# EAGLE design main0 (EAGLE 8.3.1)
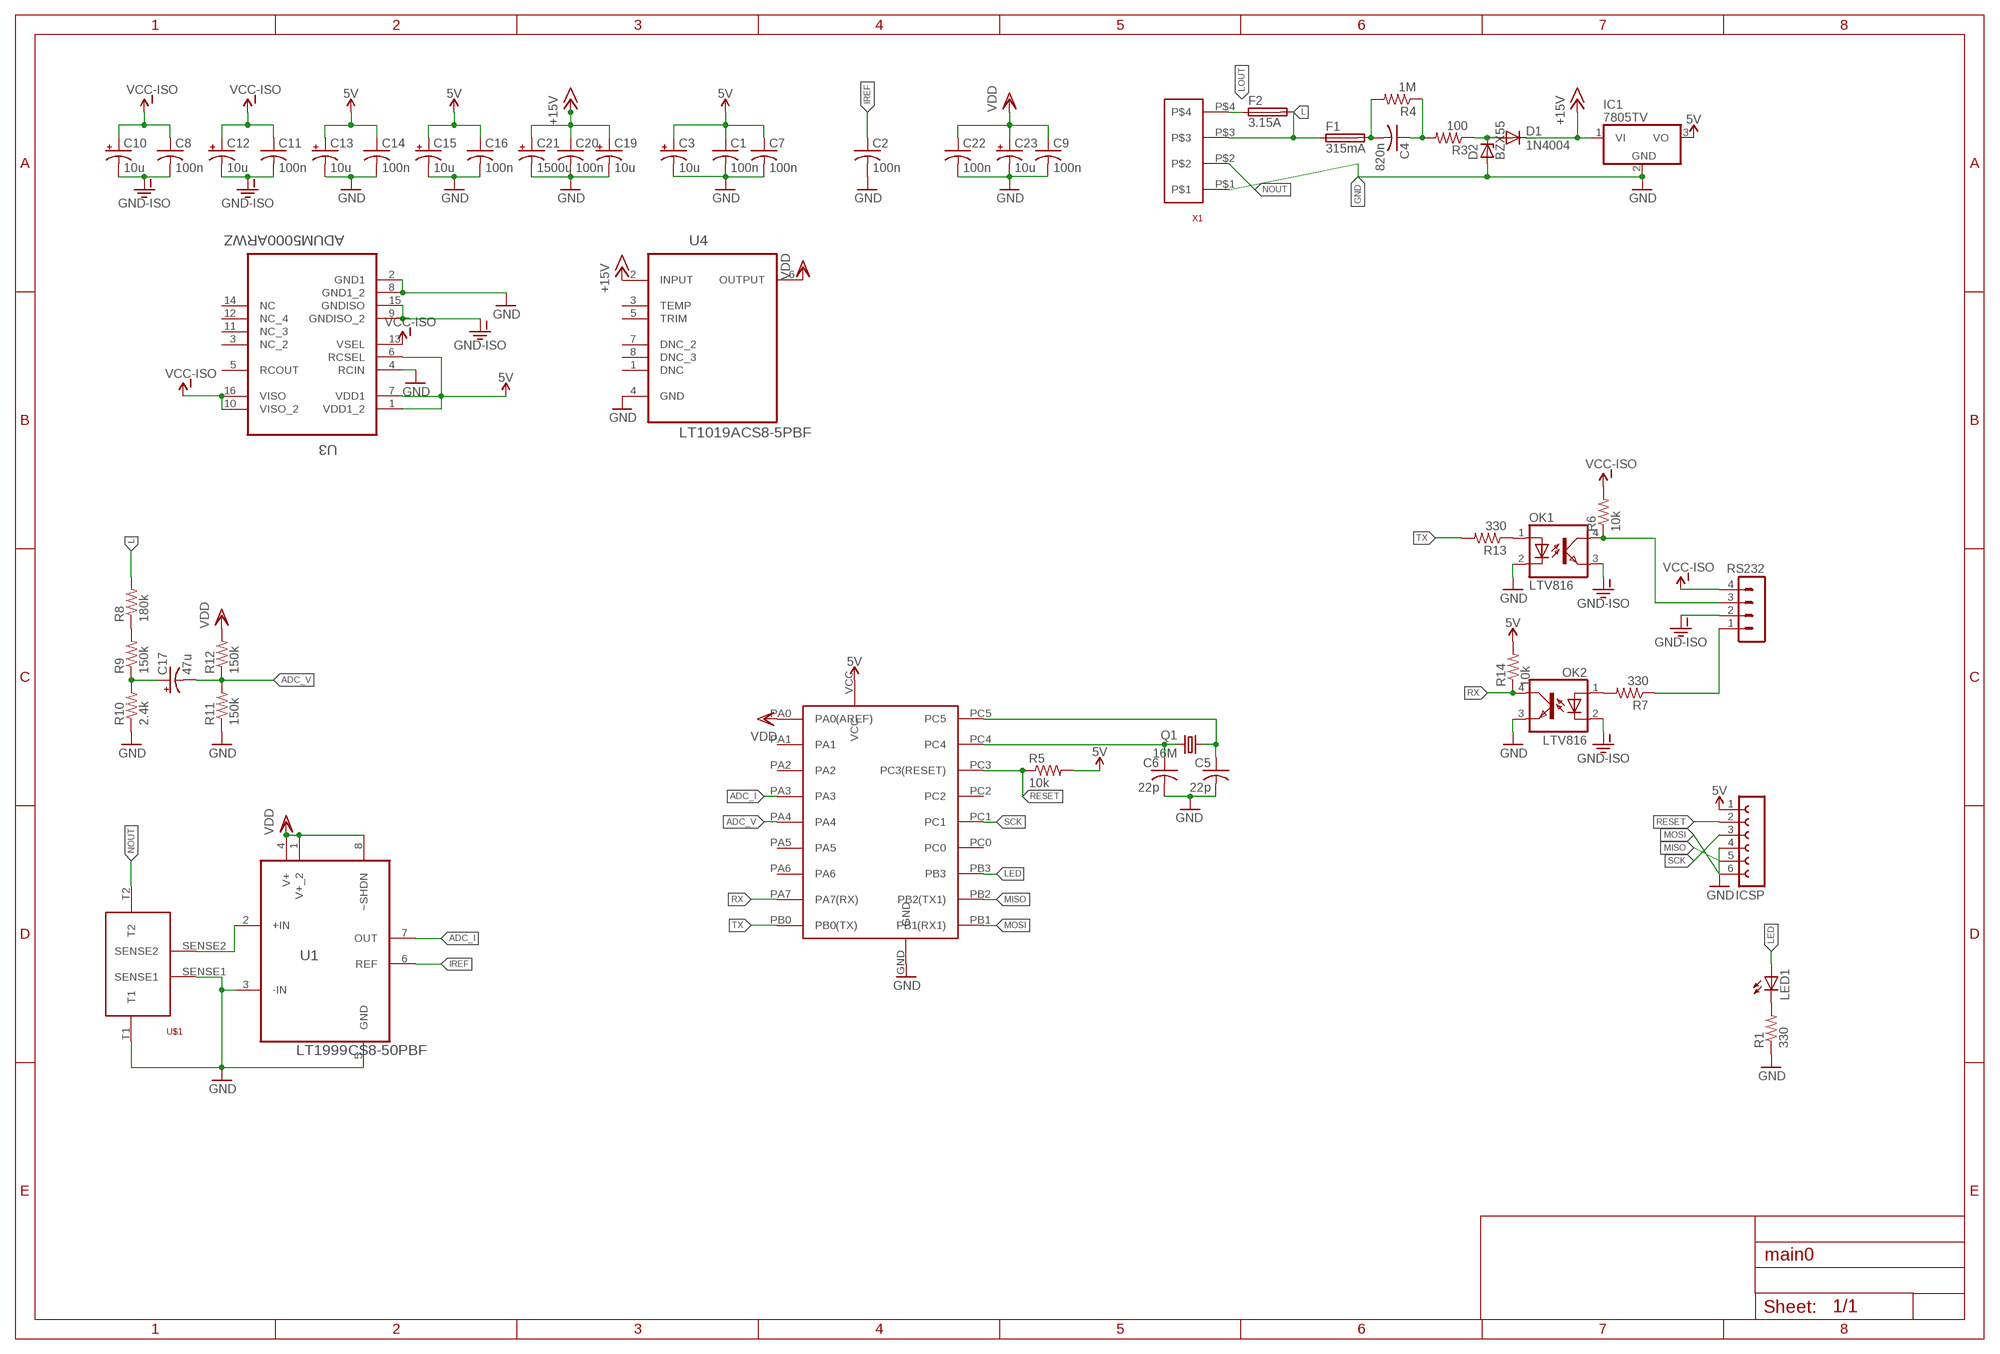
[diagram p0: schematic, sheet 1]

## Parts
C1  100n  C-USC0805  [C0805]
C2  100n  C-USC0805  [C0805]
C3  10u  CPOL-USE2.5-5  [E2,5-5]
C4  820n  C-US225-087X268  [C225-087X268]
C5  22p  C-US025-025X050  [C025-025X050]
C6  22p  C-US025-025X050  [C025-025X050]
C7  100n  C-USC0805  [C0805]
C8  100n  C-USC0805  [C0805]
C9  100n  C-USC0805  [C0805]
C10  10u  CPOL-USE2.5-5  [E2,5-5]
C11  100n  C-USC0805  [C0805]
C12  10u  CPOL-USE2.5-5  [E2,5-5]
C13  10u  CPOL-USE2.5-5  [E2,5-5]
C14  100n  C-USC0805  [C0805]
C15  10u  CPOL-USE2.5-5  [E2,5-5]
C16  100n  C-USC0805  [C0805]
C17  47u  CPOL-USE2.5-6  [E2,5-6]
C19  10u  CPOL-USE2.5-5  [E2,5-5]
C20  100n  C-USC0805  [C0805]
C21  1500u  CPOL-USE3.5-10  [E3,5-10]
C22  100n  C-USC0805  [C0805]
C23  10u  CPOL-USE2.5-5  [E2,5-5]
D1  1N4004  [DO41-10]
D2  BZX55  [DO35Z10]
F1  315mA  FUSESH22,5  [SH22,5]
F2  3.15A  FUSESH22,5  [SH22,5]
IC1  7805TV  [TO220V]
ICSP  FE06-1  [FE06]
LED1  LEDCHIPLED_0805  [CHIPLED_0805]
OK1  LTV816  [DIL04]
OK2  LTV816  [DIL04]
Q1  16M  CRYSTALHC49U-V  [HC49U-V]
R1  330  R-US_M0805  [M0805]
R3  100  R-US_0411/12  [0411/12]
R4  1M  R-US_0309/12  [0309/12]
R5  10k  R-US_M0805  [M0805]
R6  10k  R-US_M0805  [M0805]
R7  330  R-US_M0805  [M0805]
R8  180k  R-US_0204/7  [0204/7]
R9  150k  R-US_0204/7  [0204/7]
R10  2.4k  R-US_0207/10  [0207/10]
R11  150k  R-US_M0805  [M0805]
R12  150k  R-US_M0805  [M0805]
R13  330  R-US_M0805  [M0805]
R14  10k  R-US_M0805  [M0805]
RS232  MA04-1  [MA04-1]
U1  LT1999CS8-50PBF  [SOIC127P600X175-8N]
U3  ADUM5000ARWZ  [SOIC127P1032X265-16N]
U4  LT1019ACS8-5PBF  [SOIC127P600X175-8N]
U$1  CSR2TTE30L0F  [CSR2TTE30L0F]
U$8  ATTINY1634  [SOIC20]
X1  SCREWTERM_5MM_4WAY  [SCREWTERM_5MM_4WAY]

## Nets
5V: C1.1 C3.+ C7.1 C13.+ C14.1 C15.+ C16.1 IC1.3(VO) ICSP.1 R5.2 R14.2 U3.1(VDD1_2) U3.6(RCSEL) U3.7(VDD1) U$8.VCC
+15V: C19.+ C20.1 C21.+ D1.C IC1.1(VI) U4.2(INPUT)
ADC_I: U1.7(OUT) U$8.PA3
ADC_V: C17.- R11.2 R12.1 U$8.PA4
GND: C1.2 C2.2 C3.- C5.2 C6.2 C7.2 C9.2 C13.- C14.2 C15.- C16.2 C19.- C20.2 C21.- C22.2 C23.- D2.A IC1.2(GND) ICSP.4 OK1.2(C) OK2.3(EMIT) R1.1 R10.1 R11.1 U1.3(-IN) U1.5(GND) U3.2(GND1) U3.4(RCIN) U3.8(GND1_2) U4.4(GND) U$1.SENSE1 U$1.T1 U$8.GND X1.P$1
GND-ISO: C8.2 C10.- C11.2 C12.- OK1.3(EMIT) OK2.2(C) RS232.2 U3.9(GNDISO_2) U3.15(GNDISO)
IREF: C2.1 U1.6(REF)
L: F1.1 F2.2 R8.2 X1.P$3
LED: LED1.A U$8.PB3
LOUT: F2.1 X1.P$4
MISO: ICSP.5 U$8.PB2(PB2(TX1))
MOSI: ICSP.6 U$8.PB1(PB1(RX1))
N$1: C4.1 R3.2 R4.1
N$2: C4.2 F1.2 R4.2
N$3: D1.A D2.C R3.1
N$4: U1.2(+IN) U$1.SENSE2
N$5: OK1.4(COL) R6.1 RS232.3
N$6: C5.1 Q1.1 U$8.PC5
N$7: LED1.C R1.2
N$10: C6.1 Q1.2 U$8.PC4
N$15: OK2.1(A) R7.2
N$16: R7.1 RS232.1
N$19: R8.1 R9.2
N$20: C17.+ R9.1 R10.2
N$23: OK1.1(A) R13.1
NOUT: U$1.T2 X1.P$2
RESET: ICSP.2 R5.1 U$8.PC3(PC3(RESET))
RX: OK2.4(COL) R14.1 U$8.PA7(PA7(RX))
SCK: ICSP.3 U$8.PC1
TX: R13.2 U$8.PB0(PB0(TX))
VCC-ISO: C8.1 C10.+ C11.1 C12.+ R6.2 RS232.4 U3.10(VISO_2) U3.13(VSEL) U3.16(VISO)
VDD: C9.1 C22.1 C23.+ R12.2 U1.1(V+_2) U1.4(V+) U1.8(~SHDN) U4.6(OUTPUT) U$8.PA0(PA0(AREF))
Unconnected: U3.3(NC_2) U3.5(RCOUT) U3.11(NC_3) U3.12(NC_4) U3.14(NC) U4.1(DNC) U4.3(TEMP) U4.5(TRIM) U4.7(DNC_2) U4.8(DNC_3) U$8.PA1 U$8.PA2 U$8.PA5 U$8.PA6 U$8.PC0 U$8.PC2

## Library data of the parts
C1 C2 C4-C9 C11 C14 C16 C20 C22 = adafruit:C-US: CAPACITOR, American symbol
C3 C10 C12 C13 C15 C17 C19 C21 C23 = adafruit:CPOL-US: POLARIZED CAPACITOR, American symbol
D1 = diode:1N4004: DIODE general purpose rectifier, 1 A
D2 = diode:BZX55: Z DIODE
F1 F2 = fuse:FUSE: Fuse; OC_FARNELL: unknown; OC_NEWARK: unknown
IC1 = linear:78*: Positive VOLTAGE REGULATOR Source: http://cache.national.com/ds/LM/LM78L05.pdf http://www.fairchildsemi.com/ds/LM/LM7805.pdf
ICSP = con-lsta:FE06-1: FEMALE HEADER; OC_FARNELL: unknown; OC_NEWARK: unknown
LED1 = adafruit:LED: LED OSRAM: - CHIPLED LG R971, LG N971, LY N971, LG Q971, LY Q971, LO R971, LY R971 LH N974, LH R974 LS Q976, LO Q976, LY Q976 LO Q996 - Hyper CHIPLED LW Q18S LB Q993, LB Q99A, LB R99A - SideLED LS A670, LO A670, LY A670, LG A670, LP A670 LB A673, LV A673, LT A673, LW A673 LH A674 LY A675 LS A676, LA A676, LO A676, LY A676, LW A676 LS A679, LY A679, LG A679 - Hyper Micro SIDELED® LS Y876, LA Y876, LO Y876, LY Y876 LT Y87S - SmartLED LW L88C, LW L88S LB L89C, LB L89S, LG L890 LS L89K, LO L89K, LY L89K LS L896, LA L896, LO L896, LY L896 - TOPLED LS T670, LO T670, LY T670, LG T670, LP T670 LSG T670, LSP T670, LSY T670, LOP T670, LYG T670 LG T671, LOG T671, LSG T671 LB T673, LV T673, LT T673, LW T673 LH T674 LS T676, LA T676, LO T676, LY T676, LB T676, LH T676, LSB T676, LW T676 LB T67C, LV T67C, LT T67C, LS T67K, LO T67K, LY T67K, LW E67C LS E67B, LA E67B, LO E67B, LY E67B, LB E67C, LV E67C, LT E67C LW T67C LS T679, LY T679, LG T679 LS T770, LO T770, LY T770, LG T770, LP T770 LB T773, LV T773, LT T773, LW T773 LH T774 LS E675, LA E675, LY E675, LS T675 LS T776, LA T776, LO T776, LY T776, LB T776 LHGB T686 LT T68C, LB T68C - Hyper Mini TOPLED® LB M676 - Mini TOPLED Santana® LG M470 LS M47K, LO M47K, LY M47K Source: http://www.osram.convergy.de/
OK1 OK2 = optocoupler:LTV816: OPTO COUPLER Source: LITEON, LTV816.pdf; OC_FARNELL: unknown; OC_NEWARK: unknown
Q1 = crystal:CRYSTAL: CRYSTAL; OC_FARNELL: 1666969; OC_NEWARK: unknown
R1 R3-R14 = adafruit:R-US_: RESISTOR, American symbol
RS232 = con-lstb:MA04-1: PIN HEADER; OC_FARNELL: unknown; OC_NEWARK: unknown
U1 = LTC_By_element14_Batch_1:LT1999CS8-50PBF: High Voltage, Bidirectional Current Sense Amplifier; MPN: LT1999CS8-50#PBF; OC_FARNELL: 1868097; OC_NEWARK: 24T0472; PACKAGE: SOIC-8; SUPPLIER: LINEAR TECHNOLOGY
U3 = Analog Devices_By_element14_Batch_1:ADUM5000ARWZ: 2.5 kV, Isolated DC-to-DC Converter; MPN: ADUM5000ARWZ; OC_FARNELL: 1701256; OC_NEWARK: 19P8235; PACKAGE: SOIC-16; SUPPLIER: Analog Devices
U4 = LTC_By_element14_Batch_1:LT1019ACS8-5PBF: Precision Reference; MPN: LT1019ACS8-5#PBF; OC_FARNELL: 1627479; OC_NEWARK: 57M0906; PACKAGE: SOIC-8; SUPPLIER: LINEAR TECHNOLOGY
U$1 = 7_segment_lib:CSR2TTE30L0F
U$8 = 7_segment_lib:ATTINY1634
X1 = 7_segment_lib:SCREWTERM_5MM_4WAY

## Board
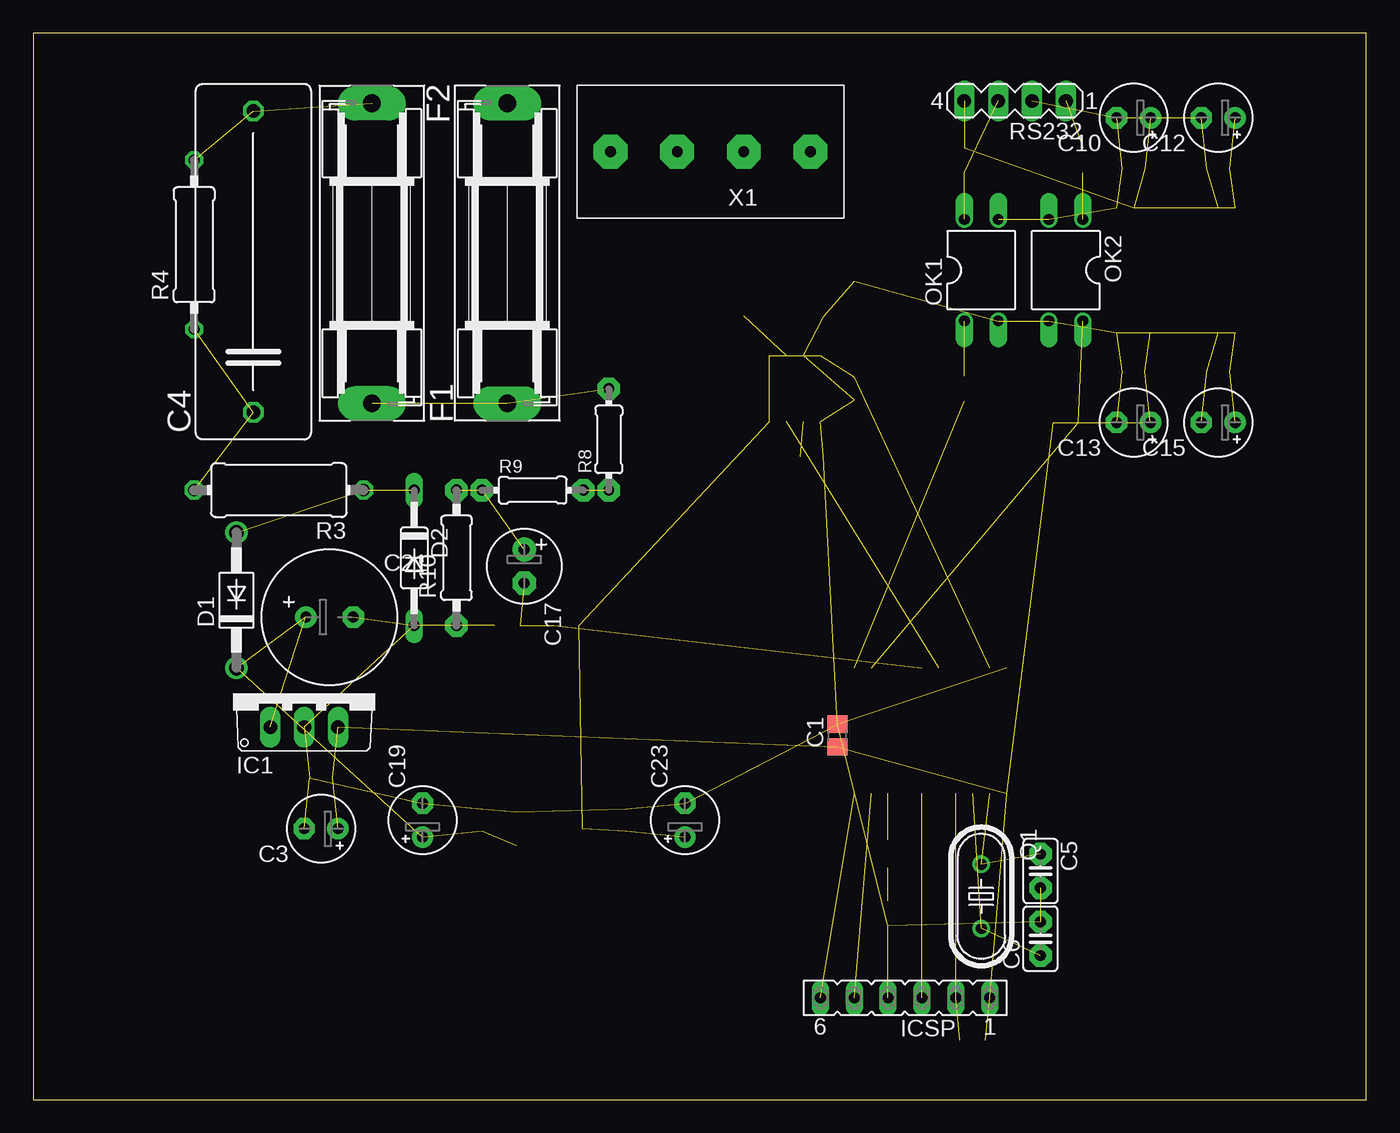
[diagram p1: board, top side]
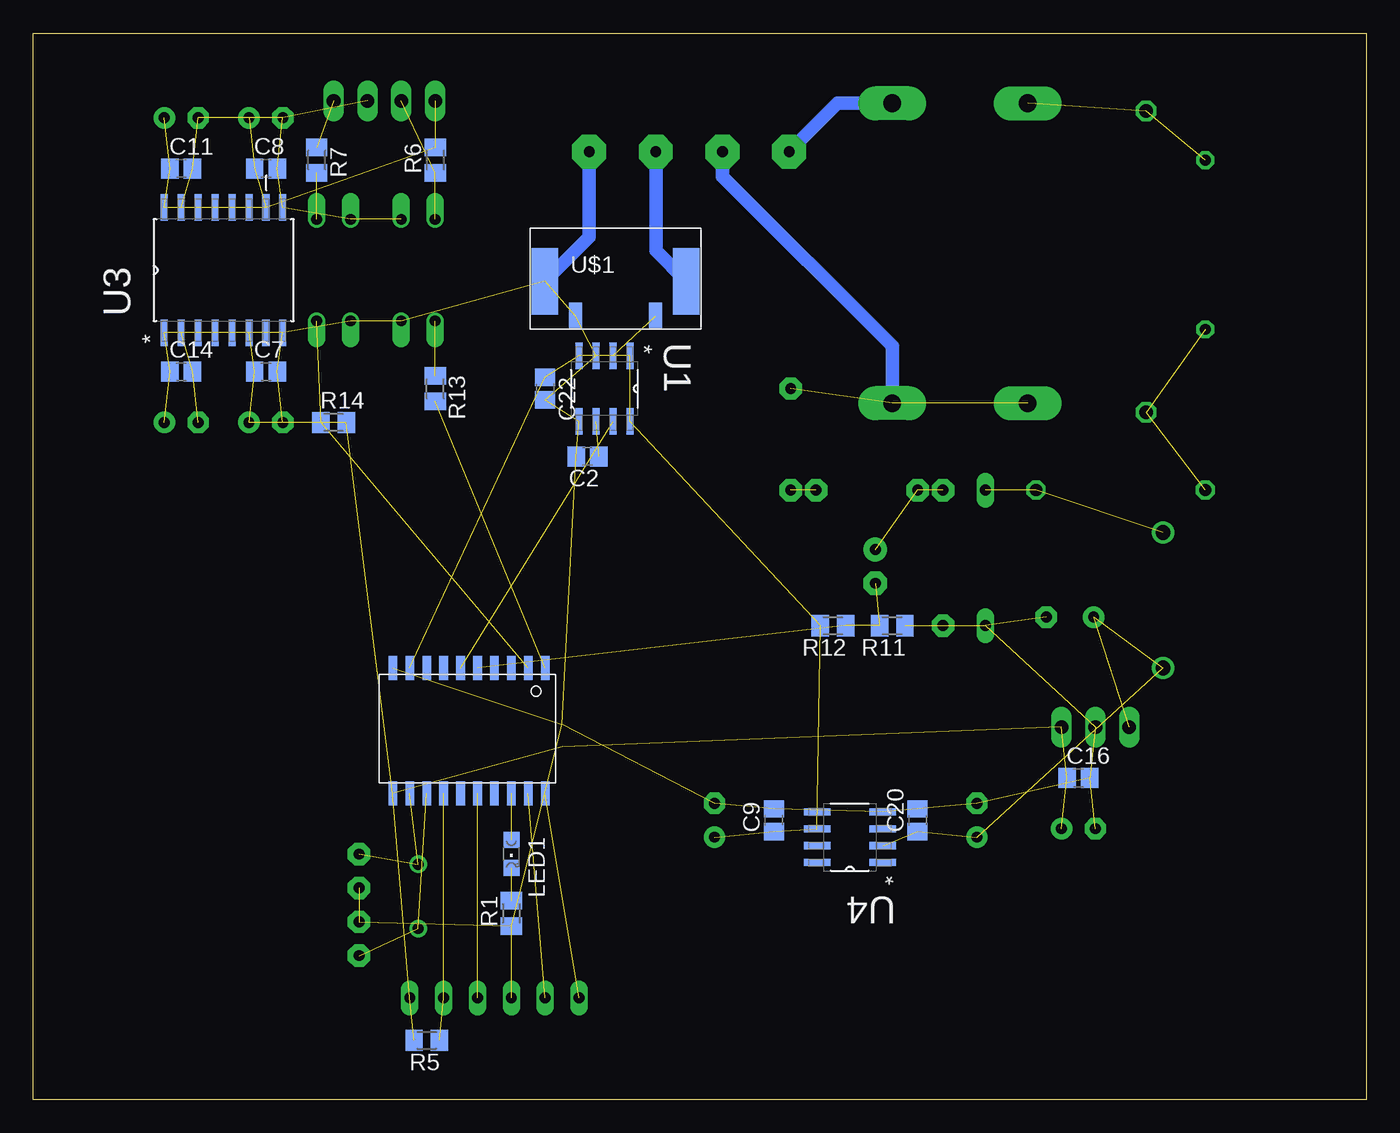
[diagram p2: board, bottom side, seen from below]

Size 100 x 80 mm. Coordinates in mm from the lower left corner, seen from the top.
Outline: 0,0 100,0 100,80 0,80 0,0
Copper layers (1*16): Top 0.035mm / dielectric 1.5mm / Bottom 0.035mm
Design rules "default": minimum track width 6mil, minimum drill 0.35mm, track to track 6mil, track to pad 6mil, pad to pad 6mil, via to via 6mil, smd to smd 6mil, copper to edge 40mil, drill to drill 6mil, minimum pad ring 10mil, minimum via ring 8mil, stop-mask expansion 4mil, vias tented up to drill 0mil, thermal gap 10mil

### Footprints (pad centres in the part's own frame; a part is rotated, then mirrored left to right if it is on the bottom)
C0805 = smd 1.3 x 1.5: 1 -0.85,0; 2 0.85,0
E2,5-5 = drill 0.813 pad 1.6: + -1.27,0 | drill 0.813 pad 1.6 octagon: - 1.27,0
C225-087X268 = drill 1.016 octagon: 1 -11.303,0; 2 11.303,0
C025-025X050 = drill 0.813 pad 1.676 octagon: 1 -1.27,0; 2 1.27,0
E2,5-6 = drill 0.813 pad 1.778: + -1.27,0 | drill 0.813 pad 1.778 octagon: - 1.27,0
E3,5-10 = drill 0.813 pad 1.6: + -1.778,0 | drill 0.813 pad 1.6 octagon: - 1.778,0
DO41-10 = drill 1.118: A 5.08,0; C -5.08,0
DO35Z10 = drill 0.813 long: A 5.08,0; C -5.08,0
SH22,5 = drill 1.321 pad 2.54 long: 1 -11.252,0; 2 11.252,0
TO220V = drill 1.016 long: 1 -2.54,-2.54; 2 0,-2.54; 3 2.54,-2.54
FE06 = drill 0.813 long: 1 -6.35,0; 2 -3.81,0; 3 -1.27,0; 4 1.27,0; 5 3.81,0; 6 6.35,0
CHIPLED_0805 = smd 1.2 x 1.2: A 0,-1.05; C 0,1.05
DIL04 = drill 0.813 offset: 1 -1.27,-3.81; 2 1.27,-3.81; 3 1.27,3.81; 4 -1.27,3.81
HC49U-V = drill 0.813: 1 -2.413,0; 2 2.413,0
M0805 = smd 1.3 x 1.6: 1 -0.95,0; 2 0.95,0
0411/12 = drill 0.914 octagon: 1 -6.35,0; 2 6.35,0
0309/12 = drill 0.813 octagon: 1 -6.35,0; 2 6.35,0
0204/7 = drill 0.813 pad 1.676 octagon: 1 -3.81,0; 2 3.81,0
0207/10 = drill 0.813 pad 1.676 octagon: 1 -5.08,0; 2 5.08,0
MA04-1 = drill 1.016 long: 1 -3.81,0; 2 -1.27,0; 3 1.27,0; 4 3.81,0
SOIC127P600X175-8N = smd 1.981 x 0.533: 1 -2.464,1.905; 2 -2.464,0.635; 3 -2.464,-0.635; 4 -2.464,-1.905; 5 2.464,-1.905; 6 2.464,-0.635; 7 2.464,0.635; 8 2.464,1.905
SOIC127P1032X265-16N = smd 1.981 x 0.533: 1 -4.699,4.445; 2 -4.699,3.175; 3 -4.699,1.905; 4 -4.699,0.635; 5 -4.699,-0.635; 6 -4.699,-1.905; 7 -4.699,-3.175; 8 -4.699,-4.445; 9 4.699,-4.445; 10 4.699,-3.175; 11 4.699,-1.905; 12 4.699,-0.635; 13 4.699,0.635; 14 4.699,1.905; 15 4.699,3.175; 16 4.699,4.445
CSR2TTE30L0F = smd 1 x 2: SENSE1 -2.8,-2.8; SENSE2 3.2,-2.8 | smd 2 x 5: T1 -5.1,-0.2; T2 5.5,-0.2
SOIC20 = smd 1.8 x 0.65: GND -5.08,-5.08; PA0 -5.08,-3.81; PA1 -5.08,-2.54; PA2 -5.08,-1.27; PA3 -5.08,0; PA4 -5.08,1.27; PA5 -5.08,2.54; PA6 -5.08,3.81; PA7 -5.08,5.08; PB0 -5.08,6.35; PB1 4.32,6.35; PB2 4.32,5.08; PB3 4.32,3.81; PC0 4.32,2.54; PC1 4.32,1.27; PC2 4.32,0; PC3 4.32,-1.27; PC4 4.32,-2.54; PC5 4.32,-3.81; VCC 4.32,-5.08
SCREWTERM_5MM_4WAY = drill 0.8 pad 2.54 octagon: P$1 -7.5,0; P$2 -2.5,0; P$3 2.5,0; P$4 7.5,0

### Placement (x,y rotation side)
C1  60.33,27.3 90 top
C2  58.42,48.26 180 bottom
C3  21.59,20.32 180 top
C4  16.51,62.87 90 top
C5  75.56,17.14 270 top
C6  75.56,12.06 90 top
C7  82.55,54.61 0 bottom
C8  82.55,69.85 0 bottom
C9  44.45,20.95 90 bottom
C10  82.55,73.66 180 top
C11  88.9,69.85 0 bottom
C12  88.9,73.66 180 top
C13  82.55,50.8 180 top
C14  88.9,54.61 0 bottom
C15  88.9,50.8 180 top
C16  21.59,24.13 0 bottom
C17  36.83,40.01 270 top
C19  29.21,20.95 90 top
C20  33.66,20.95 90 bottom
C21  22.23,36.2 0 top
C22  61.59,53.34 270 bottom
C23  48.9,20.95 90 top
D1  15.24,37.47 90 top
D2  28.57,40.64 270 top
F1  25.4,63.5 90 top
F2  35.56,63.5 270 top
IC1  20.32,30.48 0 top
ICSP  65.41,7.62 180 top
LED1  64.14,18.41 180 bottom
OK1  71.12,62.23 0 top
OK2  77.47,62.23 180 top
Q1  71.12,15.24 270 top
R1  64.14,13.97 90 bottom
R3  18.41,45.72 180 top
R4  12.06,64.14 90 top
R5  70.48,4.45 180 bottom
R6  69.85,70.48 90 bottom
R7  78.74,70.48 270 bottom
R8  43.18,49.53 90 top
R9  37.47,45.72 0 top
R10  31.75,40.64 90 top
R11  35.56,35.56 180 bottom
R12  40.01,35.56 180 bottom
R13  69.85,53.34 270 bottom
R14  77.47,50.8 0 bottom
RS232  73.66,74.93 180 top
U1  57.15,53.34 270 bottom
U3  85.72,62.23 90 bottom
U4  38.73,19.68 180 bottom
U$1  56.52,61.59 0 bottom
U$8  67.94,27.3 270 bottom
X1  50.8,71.12 180 top

### Tracks (layer width: path | path; a pad name or v marks a point on that pad's centre or on a via)
5V  (14 unrouted)
+15V  (5 unrouted)
ADC_I  (1 unrouted)
ADC_V  (3 unrouted)
GND  (32 unrouted)
  Bottom 1.016: X1.P$1 58.3,64.71 U$1.T1
GND-ISO  (8 unrouted)
IREF  (1 unrouted)
L  (2 unrouted)
  Bottom 1.016: X1.P$3 48.3,69.25 35.56,56.52 F2.2
LED  (1 unrouted)
LOUT
  Bottom 1.016: F2.1 39.67,74.75 X1.P$4
MISO  (1 unrouted)
MOSI  (1 unrouted)
N$1  (2 unrouted)
N$2  (2 unrouted)
N$3  (2 unrouted)
N$4  (1 unrouted)
N$5  (2 unrouted)
N$6  (2 unrouted)
N$7  (1 unrouted)
N$10  (2 unrouted)
N$15  (1 unrouted)
N$16  (1 unrouted)
N$19  (1 unrouted)
N$20  (2 unrouted)
N$23  (1 unrouted)
NOUT
  Bottom 1.016: X1.P$2 53.3,63.68 U$1.T2
RESET  (2 unrouted)
RX  (2 unrouted)
SCK  (1 unrouted)
TX  (1 unrouted)
VCC-ISO  (8 unrouted)
VDD  (8 unrouted)